# Altium schematic sheet SportsLight.SchDoc
size A3
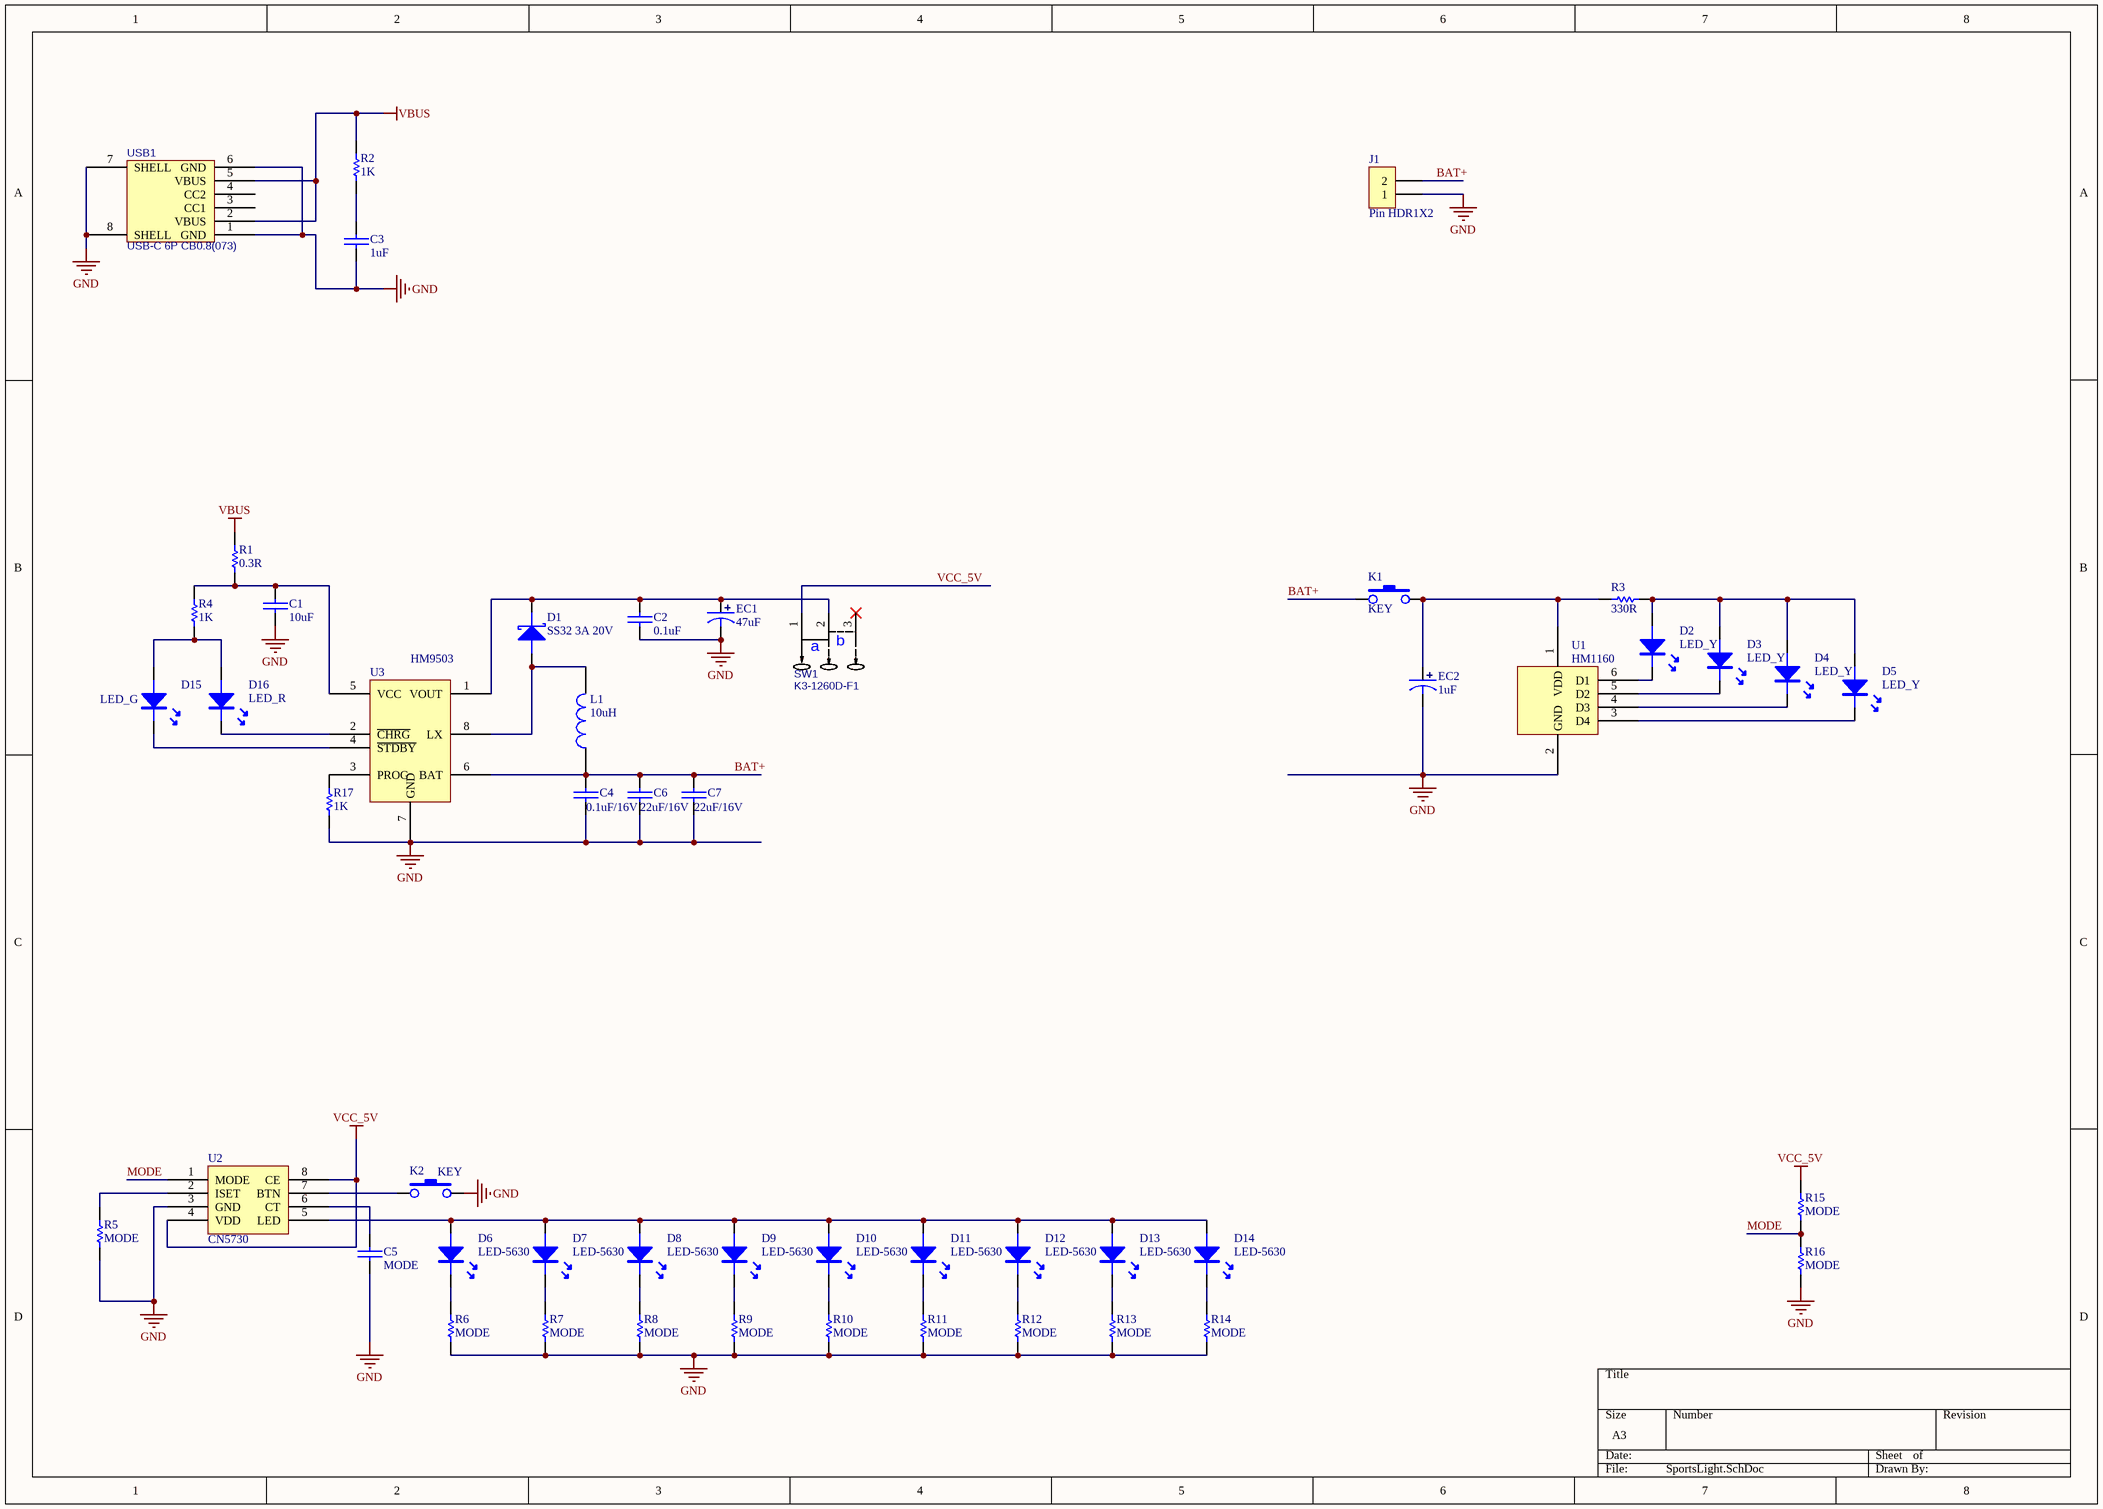
[diagram p0: SportsLight.SchDoc]

## Parts
C1  10uF  [0603C]
C2  0.1uF  [0603C]
C3  1uF  [0603C]
C4  0.1uF/16V  [0603C]
C5  MODE  [0603C]
C6  22uF/16V  [0603C]
C7  22uF/16V  [0603C]
D1  SS32 3A 20V  [SMA/DO-214AC]
D2  LED_Y  [LED-0602-RD]
D3  LED_Y  [LED-0602-RD]
D4  LED_Y  [LED-0602-RD]
D5  LED_Y  [LED-0602-RD]
D6  LED-5630  [LED-5630W]
D7  LED-5630  [LED-5630W]
D8  LED-5630  [LED-5630W]
D9  LED-5630  [LED-5630W]
D10  LED-5630  [LED-5630W]
D11  LED-5630  [LED-5630W]
D12  LED-5630  [LED-5630W]
D13  LED-5630  [LED-5630W]
D14  LED-5630  [LED-5630W]
D15  LED_G  [LED-0602-RD]
D16  LED_R  [LED-0602-RD]
EC1  47uF  [SMD-EC4.0X4.3X5.4]
EC2  1uF  [SMD-EC4.0X4.3X5.4]
J1  Pin HDR1X2  [Pin HDR1X2/2.54mm-S]
K1  KEY  [SMD-3.5x7.8x2.5_C]
K2  KEY  [SMD-3.5x7.8x2.5_C]
L1  10uH  [0630L]
R1  0.3R  [0603R]
R2  1K  [0603R]
R3  330R  [0603R]
R4  1K  [0603R]
R5  MODE  [0603R]
R6  MODE  [0603R]
R7  MODE  [0603R]
R8  MODE  [0603R]
R9  MODE  [0603R]
R10  MODE  [0603R]
R11  MODE  [0603R]
R12  MODE  [0603R]
R13  MODE  [0603R]
R14  MODE  [0603R]
R15  MODE  [0603R]
R16  MODE  [0603R]
R17  1K  [0603R]
SW1  K3-1260D-F1  [SK-3260D-01-L3]
U1  HM1160  [SOT23-6]
U2  CN5730  [ESOP8]
U3  HM9503  [ESOP8]
USB1  USB-C 6P CB0.8(073)  [USB-C-SMD_TYPE-C-6P-CB0.8-073]

## Nets
GND: C1.1 C2.1 C3.1 C4.1 C5.2 C6.1 C7.1 EC1.2 EC2.2 J1.1 K2.3 R5.1 R6.1 R7.1 R8.1 R9.1 R10.1 R11.1 R12.1 R13.1 R14.1 R16.1 R17.1 U1.2(GND) U2.3(GND) U3.7(GND) USB1.1(GND) USB1.6(GND) USB1.7(SHELL) USB1.8(SHELL)
VBUS: R1.2 R2.2 USB1.2(VBUS) USB1.5(VBUS)
VCC_5V: R15.1 SW1.1 U2.4(VDD) U2.8(CE)
BAT+: C4.2 C6.2 C7.2 J1.2 K1.1 L1.1 U3.6(BAT)
MODE: R15.2 R16.2 U2.1(MODE)
NetC1_2: C1.2 R1.1 R4.2 U3.5(VCC)
NetC2_2: C2.2 D1.K EC1.1 SW1.2 U3.1(VOUT)
NetC3_2: C3.2 R2.1
NetC5_1: C5.1 U2.6(CT)
NetD1_A: D1.A L1.2 U3.8(LX)
NetD2_A: D2.A D3.A D4.A D5.A R3.1
NetD2_K: D2.K U1.6(D1)
NetD3_K: D3.K U1.5(D2)
NetD4_K: D4.K U1.4(D3)
NetD5_K: D5.K U1.3(D4)
NetD6_A: D6.A D7.A D8.A D9.A D10.A D11.A D12.A D13.A D14.A U2.5(LED)
NetD6_K: D6.K R6.2
NetD7_K: D7.K R7.2
NetD8_K: D8.K R8.2
NetD9_K: D9.K R9.2
NetD10_K: D10.K R10.2
NetD11_K: D11.K R11.2
NetD12_K: D12.K R12.2
NetD13_K: D13.K R13.2
NetD14_K: D14.K R14.2
NetD15_A: D15.A D16.A R4.1
NetD15_K: D15.K U3.4(~{STDBY})
NetD16_K: D16.K U3.2(~{CHRG})
NetEC2_1: EC2.1 K1.3 R3.2 U1.1(VDD)
NetK2_1: K2.1 U2.7(BTN)
NetR5_2: R5.2 U2.2(ISET)
NetR17_2: R17.2 U3.3(PROG)

Not connected (* = marked no-connect by the designer): SW1 3*; USB1 3(CC1) 4(CC2)

## Notes on the sheet
- (in symbol K3-1260D-F1) a; b

## Library data of the parts
C1-C7 = CAP: 无极性电容
D1 = DIODE SCHOTTKY: 肖特基二极管
D2-D5 D15 D16 = LED: pin to pad: A>1 K>2
EC1 EC2 = SMD_ECAP: 贴片电解电容
K1 K2 = KEY: pin to pad: 1>3 3>4
L1 = INDUCTOR
R1-R17 = RES
SW1 = K3-1260D-F1: BOM_Manufacturer: Korean Hroparts Elec; Contributor: LCSC; BOM_Supplier: LCSC; BOM_Supplier Part: C223843; BOM_Manufacturer Part: K3-1260D-F1; BOM_JLCPCB Part Class: Extended Part; spicePre: S; spiceSymbolName: K3-1260D-F1
U1 = HM1160: 单节锂电池电量指示芯片
U2 = CN5730: LED集成驱动电路
U3 = HM9503: 1A锂电池充电和5V/1A升压控制芯片
USB1 = USB-C 6P CB0.8(073): BOM_Manufacturer: SHOU HAN(首韩); BOM_Manufacturer Part: TYPE-C 6P CB0.8(073); Contributor: LCSC; BOM_Supplier: LCSC; BOM_Supplier Part: C2858273; spicePre: U; spiceSymbolName: TYPE-C 6P CB0.8(073)